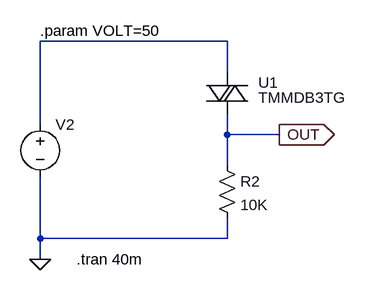
[diagram p0: schematic TMMDB3TG.asc]
TMMDB3TG.asc, the LTspice schematic file:
Version 4.1
SHEET 1 880 680
WIRE -400 0 -688 0
WIRE -400 48 -400 0
WIRE -688 128 -688 0
WIRE -400 144 -400 112
WIRE -320 144 -400 144
WIRE -400 192 -400 144
WIRE -688 304 -688 208
WIRE -400 304 -400 272
WIRE -400 304 -688 304
WIRE -688 336 -688 304
FLAG -688 336 0
FLAG -320 144 OUT
IOPIN -320 144 Out
SYMBOL voltage -688 112 R0
WINDOW 123 0 0 Left 0
WINDOW 39 0 0 Left 0
WINDOW 3 41 64 Invisible 2
SYMATTR Value SINE(0 {VOLT} 50)
SYMATTR InstName V2
SYMBOL res -416 176 R0
SYMATTR InstName R2
SYMATTR Value 10K
SYMBOL sym\\MyLib\\Diode_DIAC\\TMMDB3TG -432 48 R0
SYMATTR InstName U1
TEXT -632 336 Left 2 !.tran 40m
TEXT -688 -16 Left 2 !.param VOLT=50

The netlist it stands for:
* TMMDB3TG.asc
V2 N001 0 SINE(0 {VOLT} 50)
R2 OUT 0 10K
X§U1 N001 OUT TMMDB3TG  ; pins + -
.tran 40m
.param VOLT=50
.lib MyLib/Diode_DIAC/_DIAC_ST.lib
.backanno
.end